# Altium schematic sheet pulsePreamplifier.SchDoc
size A4
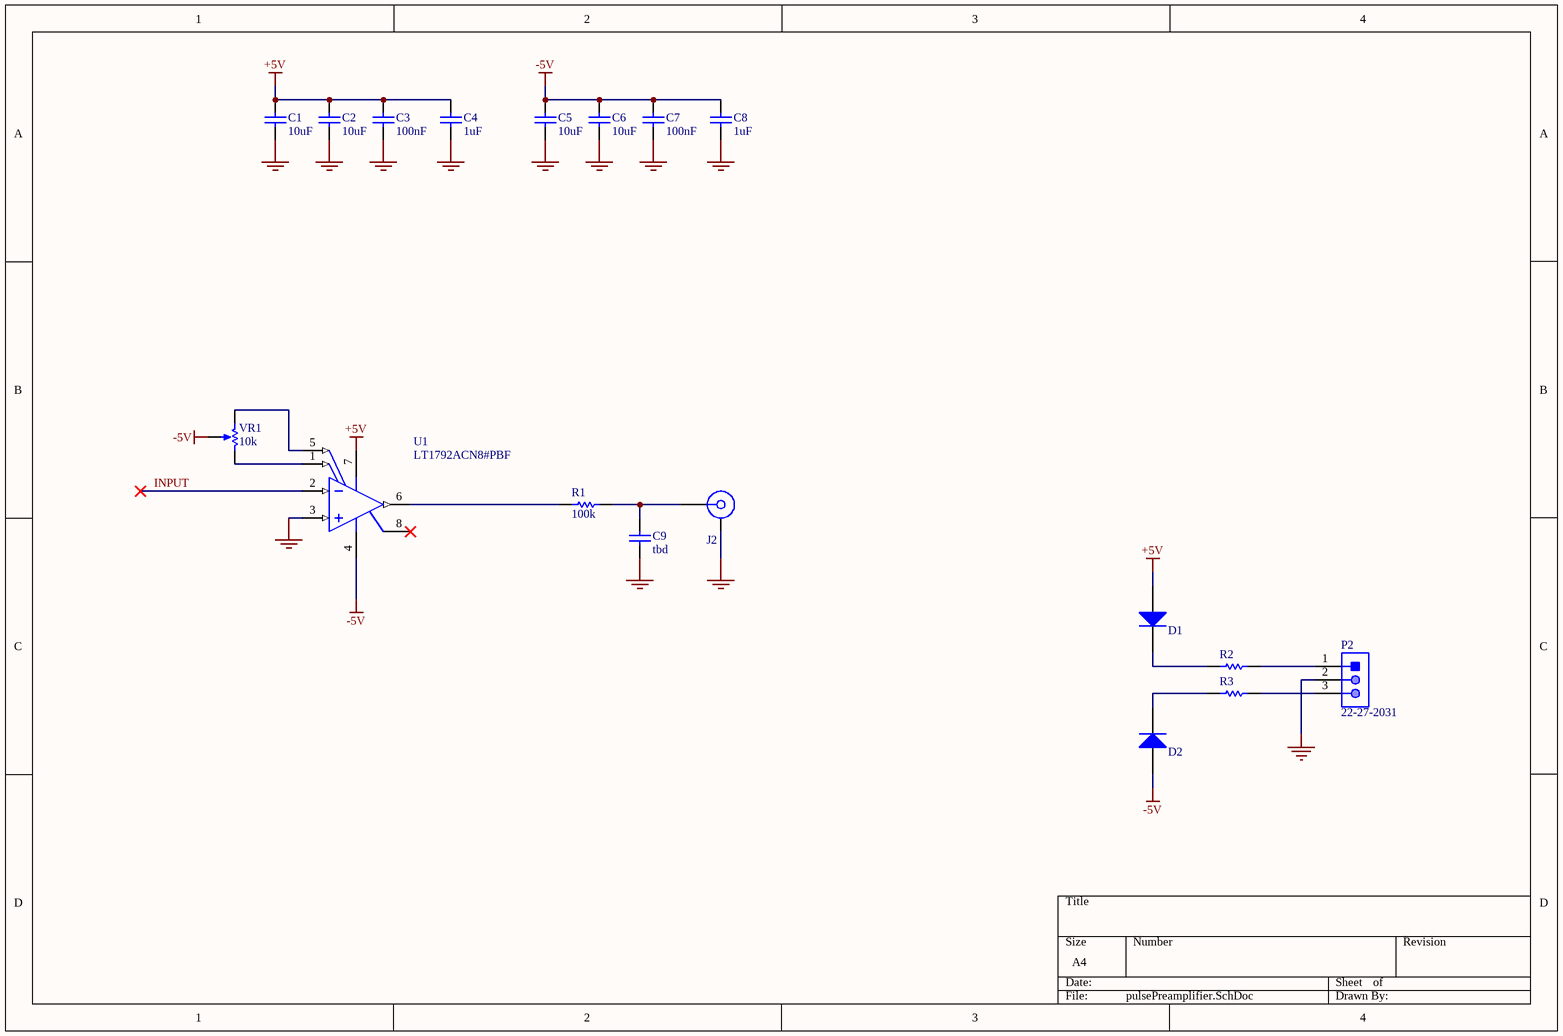
[diagram p0: pulsePreamplifier.SchDoc]

## Parts
C1  10uF  [CAPC1206(3216)130_L]
C2  10uF  [CAPC1206(3216)130_L]
C3  100nF  [CAPC0603(1608)100_N]
C4  1uF  [CAPC0603(1608)100_N]
C5  10uF  [CAPC1206(3216)130_L]
C6  10uF  [CAPC1206(3216)130_L]
C7  100nF  [CAPC0603(1608)100_N]
C8  1uF  [CAPC0603(1608)100_N]
C9  tbd  [CAPC0603(1608)100_N]
D1  MMSD4148T3G  [ONSC-SOD123-2-425G-04_V]  (value not drawn)
D2  MMSD4148T3G  [ONSC-SOD123-2-425G-04_V]  (value not drawn)
J2  32K145-400L5  [ROS-32K145-400L5_V]  (value not drawn)
P2  22-27-2031  [MOLX-22-27-2031_V]
R1  100k  [RESC0805(2012)_L]
R2  100k  [RESC0603(1608)_N]  (value not drawn)
R3  100k  [RESC0603(1608)_N]  (value not drawn)
U1  LT1792ACN8#PBF  [LT-N8-8]
VR1  10k  [BOUR-3362P]

## Nets
+5V: C1.2 C2.2 C3.2 C4.2 D1.2(ANODE) U1.7(V+)
-5V: C5.2 C6.2 C7.2 C8.2 D2.2(ANODE) U1.4(V-) VR1.2(S)
GND: C1.1 C2.1 C3.1 C4.1 C5.1 C6.1 C7.1 C8.1 C9.2 J2.MP P2.2 U1.3(+IN_A)
INPUT: U1.2(-IN_A)
NetC9_1: C9.1 J2.1 R1.1
NetD1_1: D1.1(CATHODE) R2.2
NetD2_1: D2.1(CATHODE) R3.2
NetP2_1: P2.1 R2.1
NetP2_3: P2.3 R3.1
NetR1_2: R1.2 U1.6(OUT)
NetU1_1: U1.1(VOS_ADJ) VR1.1(CCW)
NetU1_5: U1.5(VOS_ADJ) VR1.3(CW)

Not connected (* = marked no-connect by the designer): U1 8(NC)*

## Library data of the parts
C1 C2 C5 C6 = CMP-1037-04970-1: CAP 10uF 10V -20% to +80% 1206 (3216 Metric) Thickness 1.3mm SMD; Case-Metric: 3216; Case-EIA: 1206; Value: 10uF; Rated Voltage: 10 V; Technology: SMT; Max Thickness: 1.3 mm; Tolerance: -20% to +80%
C3 C7 = CMP-1035-02589-1: CAP 100nF 25V ±20% 0603 (1608 Metric) Thickness 1mm SMD; Case-EIA: 0603; Tolerance: Â±20%; Case-Metric: 1608; Value: 100nF; Max Thickness: 1 mm; Technology: SMT; Rated Voltage: 25 V
C4 C8 C9 = CMP-1035-02589-1: CAP 1uF 25V ±20% 0603 (1608 Metric) Thickness 1mm SMD; Value: 100nF; Case-EIA: 0603; Tolerance: Â±20%; Case-Metric: 1608; Max Thickness: 1 mm; Technology: SMT; Rated Voltage: 25 V
D1 D2 = CMP-0895-00002-1: Switching Diode, 100 V, 200 mA, -55 to 150 degC, 2-Pin SOD123 (425), RoHS, Tape and Reel; Manufacturer: ON Semiconductor; CD (Max): 4 pF; IR @ VR: 75 V (Max)=50 uA; PD (Max): 425 mW; VF (Max): 1 A; Trr (Max): 4 ns; VBR (Min): 100 V; ComponentLink1URL: http://www.onsemi.com/; ComponentLink1Description: Manufacturer URL; PackageReference: SOD123-2-425G-04; PackageDescription: 2-Pin SOD123, Body 2.69 x 1.6 mm, Height 1.35 mm; ComponentLink2Description: Datasheet; Mounting Technology: Surface Mount; RoHS: TRUE; PartNumber: MMSD4148T3G; PackageVersion: Rev. 04G; DatasheetVersion: Rev. 11; Temperature Range: -55 to 150 degC; ComponentLink3Description: Package Specification; Packing: Tape and Reel; ComponentLink3URL: http://www.onsemi.com/pub_link/Collateral/425-04.PDF; ComponentLink2URL: http://www.onsemi.com/pub_link/Collateral/MMSD4148T1-D.PDF
J2 = CMP-0751-00004-2: SMA Right Angle Jack, Edge Mount, Up to 18 GHz, -55 to 155 degC; Manufacturer: Rosenberger; Desgin Note 2: For more information about DRC setting, please look at following webpage, http://techdocs.altium.com/display/SCRT/Design+Rule+for+Edge-Mount+Connectors; Design Note 1: Footprint in library is a generic example - only application specific footprint delivers High Performance; ComponentLink5Description: Webshop / RFQ; ComponentLink5URL: http://www.rosenberger.com/en/contact/sales/; ComponentLink3URL: http://rosenberger.de/ok/images/documents/db/32K145-400L5.pdf; DatasheetVersion: b00; ComponentLink2URL: http://rosenberger.de/ok/images/documents/db/32K145-400L5.pdf; ComponentLink4Description: Series Overview / Design Note; ComponentLink1Description: Manufacturer URL; PackageReference: 32K145-400L5; ComponentLink2Description: Datasheet; PartNumber: 32K145-400L5; PackageVersion: b00; PackageDescription: SMA Right Angle Jack, Edge Mount, 14.25 x 9.5 x 4.46 mm; ComponentLink3Description: Package Specification; ComponentLink1URL: http://www.rosenberger.de; ComponentLink4URL: http://rosenberger.de/ok/images/documents/spez/32.pdf; Mounting Technology: Surface Mount
P2 = CMP-2000-05538-1: Male Header, Pitch 2.54 mm, 1 x 3 Position, Height 11.7 mm, Tail Length 3.56 mm, -40 to 80 degC, RoHS, Bulk; Manufacturer: Molex; Voltage rating: 250V; Current rating: 4A; Package Reference: 22-27-2031; Housing material: Nylon(UL94V-0); Operating temperature: 0°Cto+75°C; Package Description: Male Header, Pitch 2.54 mm, 1 x 3 Position, Height 11.7 mm, Tail Length 3.56 mm; Package URL: http://www.molex.com/pdm_docs/sd/022272031_sd.pdf; Datasheet Version: 06/2016; Manufacturer URL: http://www.molex.com/; Mounting Technology: ThroughHole; Datasheet URL: http://www.molex.com/webdocs/datasheets/pdf/en-us/0022272031_PCB_HEADERS.pdf; Contact material: Tinplatedbrass
R1 = CMP-1013-00624-1: Case-Metric: 2012; Case-EIA: 0805; Value: 10200.00 Ohm; Tolerance: 1 %; Power: 0.125 W; Technology: SMT
R2 R3 = CMP-1012-00397-1: 100R 0.1W 1% 0603 (1608 Metric)  SMD; Value: 100.00 Ohm; Case-EIA: 0603; Case-Metric: 1608; Technology: SMT; Tolerance: 1 %; Power: 0.1 W
U1 = CMP-0359-01284-2: Single Channel, Low Distortion, Low Noise, Precision Operational Amplifier, 5.6 MHz Typical GBW, 3.4 V/us Typical SR, 10 to 40 V, 8-Pin DIP (N8-8), Commercial, Pb-Free; Manufacturer: Linear Technology; Linear Technology Part Number: LT1792; Vos (mV) Guaranteed: 0.6; SR (V/us) Typical: 3.4; Vs Min (V): 10; Vs Max (V): 40; Channels (#): 1; Is (mA) Typical: 4.2; Vos (mV) Typical: 0.2; GBW (MHz) Typical: 5.6; ComponentLink1Description: Manufacturer URL; PartNumber: LT1792ACN8#PBF; ComponentLink3Description: Package Specification; PackageDescription: 8-Lead PDIP, Body 10.16 x 6.48 mm, Pitch 2.54 mm; PackageVersion: Rev I; ComponentLink2URL: http://cds.linear.com/docs/en/datasheet/1792f.pdf; Mounting Technology: Surface Mount; ComponentLink1URL: http://www.linear.com/; RevisionNote: URLs updated; ComponentLink3URL: http://cds.linear.com/docs/en/packaging/05081510_I_N8.pdf; RoHS: Pb-Free; ComponentLink2Description: Datasheet; Type: JFET; PackageReference: LT-N8-8
VR1 = CMP-1747-00004-1: Square Trimpot(R) Trimming Potentiometer, 10 KOhm, 300 V, -55 to 125 degC, 3-Pin THD, RoHS, Tube; Voltage Rating: 220 mV; Power Rating: 1 W; Tolerance: 1%; Resistance: 50 mohm; Case/Package: 1206; Length: 3.2 mm; RoHSCompliant: True; PackageDescription: 3-Pin Through Hole Device, Body 6.6 x 6.99 mm, Pitch 2.54 mm; ComponentLink2Description: Datasheet; REACH SVHC: No SVHC; Mount: Surface Mount; Height: 0.6 mm; Packaging: Tape and Reel; ComponentLink1URL: http://www.bourns.com/; Case Code (Imperial): 0612; Pins: 2; Case Code (Metric): 1632; ComponentLink2URL: http://www.bourns.com/docs/Product-Datasheets/3362.pdf; Min Operating Temperature: -25degC; ComponentLink1Description: Manufacturer URL; PackageReference: 3326P; Max Operating Temperature: 125degC; Width: 1.6 mm; Package Quantity: 5000; DatasheetVersion: May-16